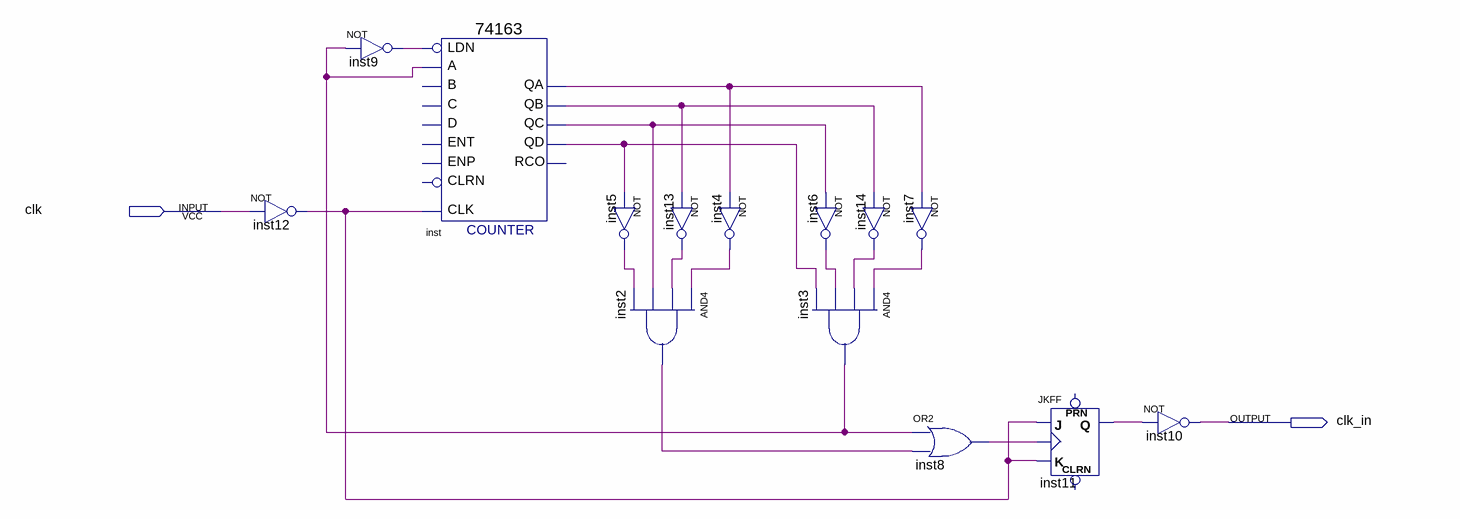
[diagram p0: schematic sheet]
// Quartus schematic block1.bdf as structural Verilog: 14 symbols, 2 pins
module block1 (
  input  clk,
  output clk_in
);

  wire inst2_out, inst3_out, inst4_out, inst5_out, inst6_out, inst7_out, inst8_out, inst9_out, inst11_q,
       inst12_out, inst13_out, inst14_out, inst_qa, inst_qb, inst_qc, inst_qd;

  not inst12 (inst12_out, clk);
  not inst9 (inst9_out, inst3_out);
  \74163  inst (
    .A(inst3_out), .CLK(inst12_out), .LDN(inst9_out), .QA(inst_qa), .QB(inst_qb), .QC(inst_qc), .QD(inst_qd));  // open: C, B, ENT, D, CLRN, ENP, RCO
  not inst5 (inst5_out, inst_qd);
  and inst2 (inst2_out, inst4_out, inst13_out, inst_qc, inst5_out);
  not inst4 (inst4_out, inst_qa);
  not inst13 (inst13_out, inst_qb);
  not inst6 (inst6_out, inst_qc);
  and inst3 (inst3_out, inst7_out, inst14_out, inst6_out, inst_qd);
  not inst14 (inst14_out, inst_qb);
  not inst7 (inst7_out, inst_qa);
  or inst8 (inst8_out, inst3_out, inst2_out);
  JKFF inst11 (.K(inst12_out), .J(inst12_out), .CLK(inst8_out), .Q(inst11_q));  // open: PRN, CLRN
  not inst10 (clk_in, inst11_q);
endmodule
